# Altium schematic sheet USB_ULPI_Interface.SchDoc: STM32F446 CNC
size B; Author: AM; CompanyName: Expatria Technologies; DrawnBy: A.Marles; Engineer: AM; Organization: Expatria Technolgoies; Address1: PO Box 2084; Address3: Merritt, BC V1K 1B8; Address4: Canada; DocumentNumber: 7; SheetNumber: 7; SheetTotal: 26
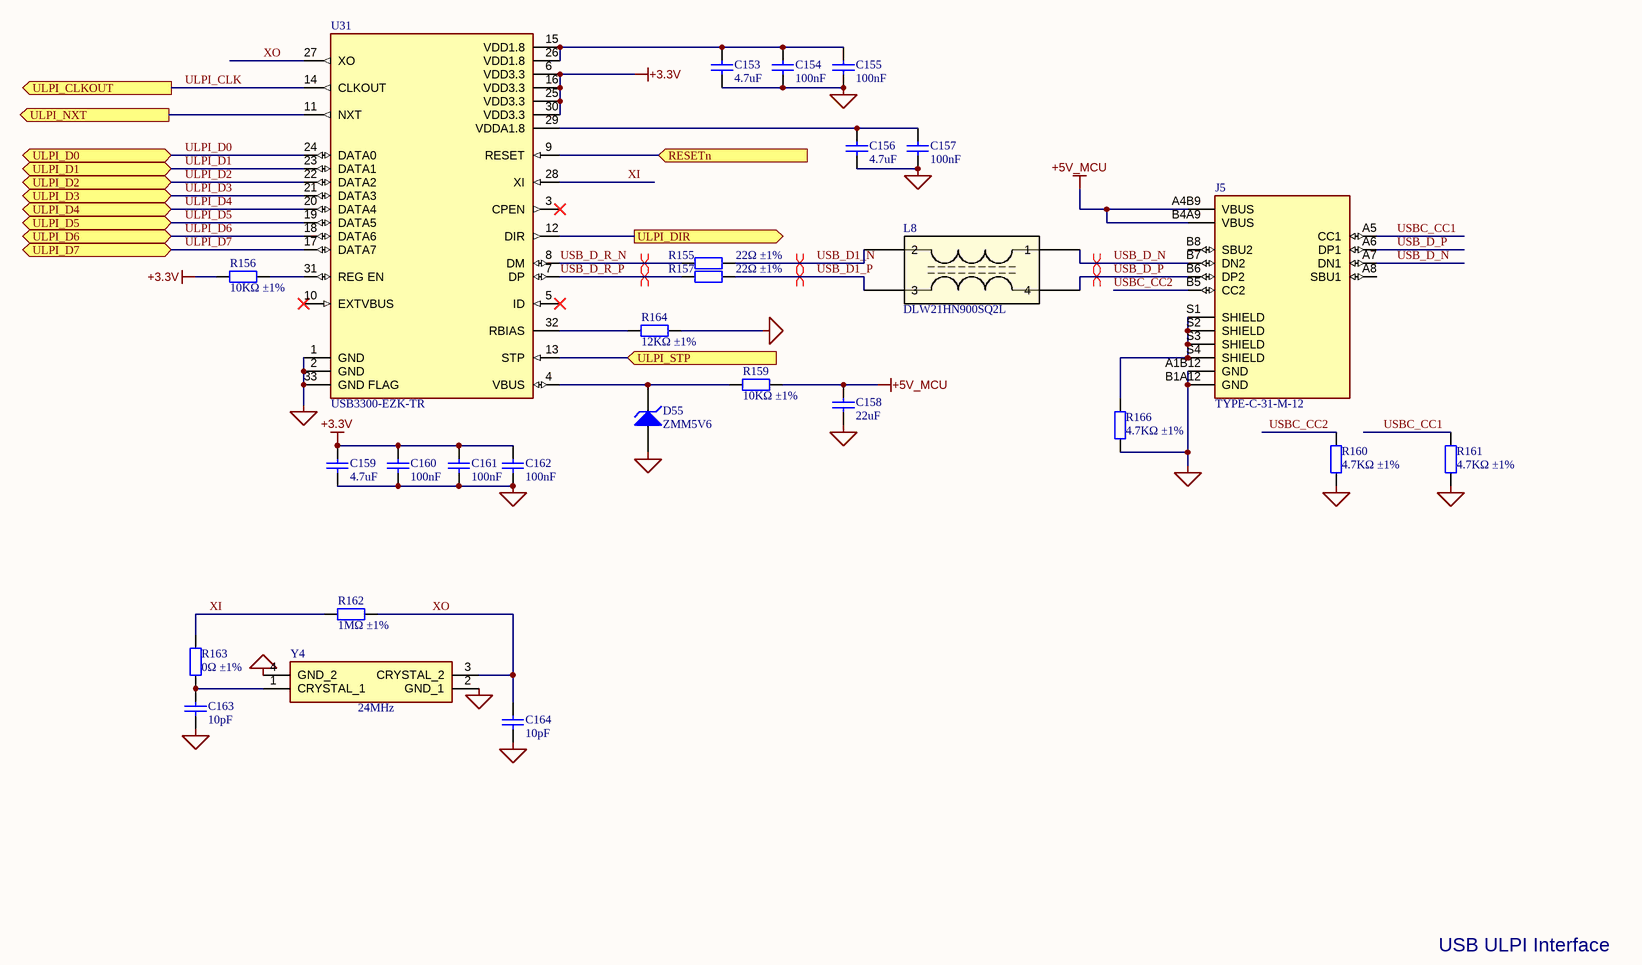
[diagram p0: USB_ULPI_Interface.SchDoc]

## Parts
C153  4.7uF  [0603_C]
C154  100nF  [0603_C]
C155  100nF  [0603_C]
C156  4.7uF  [0603_C]
C157  100nF  [0603_C]
C158  22uF  [0805_C]
C159  4.7uF  [0603_C]
C160  100nF  [0603_C]
C161  100nF  [0603_C]
C162  100nF  [0603_C]
C163  10pF  [0402_C]
C164  10pF  [0402_C]
D55  ZMM5V6  [LL-34]
J5  TYPE-C-31-M-12  [HRO_TYPE-C-31-M-12]
L8  DLW21HN900SQ2L  [DLW21HN121HQ2B]
R155  22Ω ±1%  [0603_R]
R156  10KΩ ±1%  [0603_R]
R157  22Ω ±1%  [0603_R]
R159  10KΩ ±1%  [0603_R]
R160  4.7KΩ ±1%  [0603_R]
R161  4.7KΩ ±1%  [0603_R]
R162  1MΩ ±1%  [0402_R]
R163  0Ω ±1%  [0402_R]
R164  12KΩ ±1%  [0603_R]
R166  4.7KΩ ±1%  [0603_R]
U31  USB3300-EZK-TR  [FP-32QFN-3304-5X5B-MFG]
Y4  value 24MHz  [YSX321SL]  (hidden comment: X322524MSB4SI)

## Ports
RESETn (in), ULPI_CLKOUT (out), ULPI_D0 (bidir), ULPI_D1 (bidir), ULPI_D2 (bidir), ULPI_D3 (bidir), ULPI_D4 (bidir), ULPI_D5 (bidir), ULPI_D6 (bidir), ULPI_D7 (bidir), ULPI_DIR (out), ULPI_NXT (out), ULPI_STP (in)

## Nets
+3.3V: C159.2 C160.2 C161.2 C162.2 R156.1 U31.6(VDD3.3) U31.16(VDD3.3) U31.25(VDD3.3) U31.30(VDD3.3)
+5V_MCU: C158.2 J5.A4B9(VBUS) J5.B4A9(VBUS) R159.2
MCU_GND: C153.1 C154.1 C155.1 C156.1 C157.1 C158.1 C159.1 C160.1 C161.1 C162.1 C163.1 C164.1 D55.1(A) J5.A1B12(GND) J5.B1A12(GND) R160.2 R161.2 R164.2 R166.2 U31.1(GND) U31.2(GND) U31.33(GND_FLAG) Y4.2(GND_1) Y4.4(GND_2)
RESETn: U31.9(RESET) ; port RESETn
ULPI_CLK: U31.14(CLKOUT) ; port ULPI_CLKOUT
ULPI_D0: U31.24(DATA0) ; port ULPI_D0
ULPI_D1: U31.23(DATA1) ; port ULPI_D1
ULPI_D2: U31.22(DATA2) ; port ULPI_D2
ULPI_D3: U31.21(DATA3) ; port ULPI_D3
ULPI_D4: U31.20(DATA4) ; port ULPI_D4
ULPI_D5: U31.19(DATA5) ; port ULPI_D5
ULPI_D6: U31.18(DATA6) ; port ULPI_D6
ULPI_D7: U31.17(DATA7) ; port ULPI_D7
ULPI_DIR: U31.12(DIR) ; port ULPI_DIR
ULPI_NXT: U31.11(NXT) ; port ULPI_NXT
ULPI_STP: U31.13(STP) ; port ULPI_STP
USB_D1_N: L8.2 R155.2
USB_D1_P: L8.3 R157.2
USB_D_N: J5.A7(DN1) J5.B7(DN2) L8.1
USB_D_P: J5.A6(DP1) J5.B6(DP2) L8.4
USB_D_R_N: R155.1 U31.8(DM)
USB_D_R_P: R157.1 U31.7(DP)
USBC_CC1: J5.A5(CC1) R161.1
USBC_CC2: J5.B5(CC2) R160.1
XI: R162.1 R163.1 U31.28(XI)
XO: C164.2 R162.2 U31.27(XO) Y4.3(CRYSTAL_2)
NetC153_2: C153.2 C154.2 C155.2 U31.15(VDD1.8) U31.26(VDD1.8)
NetC156_2: C156.2 C157.2 U31.29(VDDA1.8)
NetC163_2: C163.2 R163.2 Y4.1(CRYSTAL_1)
NetD55_2: D55.2(K) R159.1 U31.4(VBUS)
NetJ5_S1: J5.S1(SHIELD) J5.S2(SHIELD) J5.S3(SHIELD) J5.S4(SHIELD) R166.1
NetR156_2: R156.2 U31.31(REG_EN)
NetR164_1: R164.1 U31.32(RBIAS)

Not connected (* = marked no-connect by the designer): J5 A8(SBU1) B8(SBU2); U31 3(CPEN)* 5(ID)* 10(EXTVBUS)*

## Layout directives
differential pair: USB_D1_N, USB_D1_P, USB_D_N, USB_D_P, USB_D_R_N, USB_D_R_P

## Notes on the sheet
- USB ULPI Interface
- SHEET
- Expatria Technologies
- PO Box 2084
- Merritt, BC V1K 1B8
- PHONE: (778) 238-9336
- PROJECT
- SIZE
- ENGR
- MODIFIED
- DOCUMENT
- REV
- Copyright Expatria Technologies 2022. This document describes Open Hardware and is licensed under the CERN-OHL-S v2. No warranty is implied or expressed.
- EMAIL: info@expatria.ca
- B
- /

## Library data of the parts
C153 C156 C159 = 0603 4.7uF (475) 10% 16V: Chip capacitors; Manufacturer: Samsung Electro-Mechanics; PartNumber: CL10A475KO8NNNC; Tolerance: 10%; Voltage: 16V; ComponentLink1Description: Supplier link; ComponentLink1URL: http://www.szlcsc.com/product/details_20375.html; Package: 0603; Supplier: LC; SuppliersPartNumber: C19666; Capacitance: 4.7uF
C154 C155 C157 C160-C162 = 0603 100nF (104) 10% 50V: Chip capacitors; Manufacturer: YAGEO; PartNumber: CC0603KRX7R9BB104; Tolerance: 10%; Voltage: 50V; ComponentLink1Description: Supplier link; ComponentLink1URL: http://www.szlcsc.com/product/details_15331.html; Package: 0603; Supplier: LC; SuppliersPartNumber: C14663; Capacitance: 100nF
C158 = 0805 22uF (226) 20% 25V: Chip capacitors; Manufacturer: Samsung Electro-Mechanics; PartNumber: CL21A226MAQNNNE; Tolerance: 20%; Voltage: 25V; Package: 0805; Supplier: LC; SuppliersPartNumber: C2922481; Capacitance: 22uF; ComponentLink1Description: Supplier link; ComponentLink1URL: http://www.szlcsc.com/product/details_46786.html
C163 C164 = 0402 10pF (100) 5% 50V: Chip capacitors; Manufacturer: Samsung Electro-Mechanics; Manufacturer Part Number: CL05C100JB5NNNC; Tolerance: 5%; Voltage: 50V; ComponentLink1Description: Supplier link; ComponentLink1URL: http://www.szlcsc.com/product/details_33914.html; Package: 0402; Supplier: LC; SuppliersPartNumber: C32949; Capacitance: 10pF
D55 = LL-34 ZMM5V6: 500mW - 0.1uA @ 1V 5.6V LL-34 Zener Diodes ROHS; ComponentLink1Description: 供应商链接; ComponentLink1URL: http://www.szlcsc.com/product/details_8541.html; Package: LL-34; Supplier: LC; SuppliersPartNumber: C8062
J5 = TYPE-C-31-M-12: USB Connectors 24 Receptacle 1 8.94*7.3mm RoHS; MF: HRO Electronics Co., Ltd.; Value: *; SnapEDA_Link: https://www.snapeda.com/parts/TYPE-C-31-M-12/HRO%20Electronics%20Co.,%20Ltd./view-part/3228496/?ref=snap; Package: Package; MP: TYPE-C-31-M-12; Price: None; Availability: Unavailable; SuppliersPartNumber: C2765186
L8 = DLW21HN900SQ2L: 90Ω@100MHz -40℃~+85℃ 350mΩ 50V 2 330mA 125V SMD-4P Common Mode Filters ROHS; Manufacturer: Murata Electronics; SuppliersPartNumber: C80529; Manufacturer Part Number: DLW21HN900SQ2L; Supplier: LCSC; Value: DLW21HN900SQ2L
R155 R157 = 0603 22R (22R0) 1%: Chip resistor; Manufacturer: Uniroyal Elec; PartNumber: 0603WAF220JT5E; Power: 1/10W; ComponentLink1Description: Supplier link; ComponentLink1URL: http://www.szlcsc.com/product/details_24078.html; Package: 0603; Supplier: LC; SuppliersPartNumber: C23345; Resistance: 22Ω; Tolerance: 1%
R156 R159 = 0603 10K (1002) 1%: Chip resistor; Manufacturer: Uniroyal Elec; PartNumber: 0603WAF1002T5E; Power: 1/10W; ComponentLink1Description: Supplier link; ComponentLink1URL: http://www.szlcsc.com/product/details_26547.html; Package: 0603; Supplier: LC; SuppliersPartNumber: C25804; Resistance: 10KΩ; Tolerance: 1%
R160 R161 R166 = 0603 4.7K (4701) 1%: Chip resistor; Manufacturer: Uniroyal Elec; PartNumber: 0603WAF4701T5E; Power: 1/10W; ComponentLink1Description: Supplier link; ComponentLink1URL: http://www.szlcsc.com/product/details_23889.html; Package: 0603; Supplier: LC; SuppliersPartNumber: C23162; Resistance: 4.7KΩ; Tolerance: 1%
R162 = 0402 1M (1004) 1%: Chip resistor; Manufacturer: Uniroyal Elec; Manufacturer Part Number: 0402WGF1004TCE; Power: 1/16W; ComponentLink1Description: Supplier link; ComponentLink1URL: http://www.szlcsc.com/product/details_26826.html; Package: 0402; Supplier: LC; SuppliersPartNumber: C26083; Resistance: 1MΩ; Tolerance: 1%
R163 = 0402 0R (0R0) 1%: Chip resistor; Manufacturer: Uniroyal Elec; Manufacturer Part Number: 0402WGF0000TCE; Power: 1/16W; ComponentLink1Description: Supplier link; ComponentLink1URL: http://www.szlcsc.com/product/details_17853.html; Package: 0402; Supplier: LC; SuppliersPartNumber: C17168; Resistance: 0Ω; Tolerance: 1%
R164 = 0603 12K (1202) 1%: Chip resistor; Manufacturer: Uniroyal Elec; PartNumber: 0603WAF1202T5E; Power: 1/10W; ComponentLink1Description: Supplier link; ComponentLink1URL: http://www.szlcsc.com/product/details_23517.html; Package: 0603; Supplier: LC; SuppliersPartNumber: C22790; Resistance: 12KΩ; Tolerance: 1%
U31 = CMP-0186-00339-2: IC CONTROLLER USB 32QFN; Manufacturer: Microchip; Min Supply Voltage: 3V; Standoff Height: 0mm; Interface: USB,Other; Number Of Ports: 1; Usb Standard: USB 2.0; Nominal Supply Current: 25.5-39600uA; Max Supply Voltage: 3.6V; Temperature Range High: +85°C; Mouser Description: USB Interface IC USB 2.0 PHY ULPI; Device Class L3: USB Interface ICs; Package: 32QFN-3304-5X5B; ComponentLink2URL: http://ww1.microchip.com/downloads/en/DeviceDoc/00001783C.pdf; Ambient Temperature Range Low: -40°C; Temperature Range Low: -40°C; Temperature: -40°C to +85°C; ComponentLink2Description: Datasheet; RoHS: TRUE; Digikey Description: IC CONTROLLER USB 32QFN; Device Class L1: Integrated Circuits (ICs); Manufacturer Part Number: USB3300-EZK-TR; Automotive: No; Height: 1mm; Ipc Land Pattern Name: QFN50P500X500X85-32; Lead Free: Yes; Ambient Temperature Range High: +85°C; Category: IC; Device Class L2: Interface ICs; Octopart: https://octopart.com/usb3300-ezk-tr-microchip-24995444
Y4 = X322525MSB4SI: 24MHz SMD Crystal Resonator 20pF ±10ppm ±30ppm -40℃~+85℃ SMD3225-4P Crystals ROHS; Manufacturer 1: Yangxing Tech; Height: 0.8mm; SuppliersPartNumber: C15643; Supplier 1: LCSC; Supplier Part Number 1: C15643; Manufacturer Part Number 1: X322524MSB4SI; Manufacturer: Yangxing Tech; Manufacturer Part Number: X322524MSB4SI